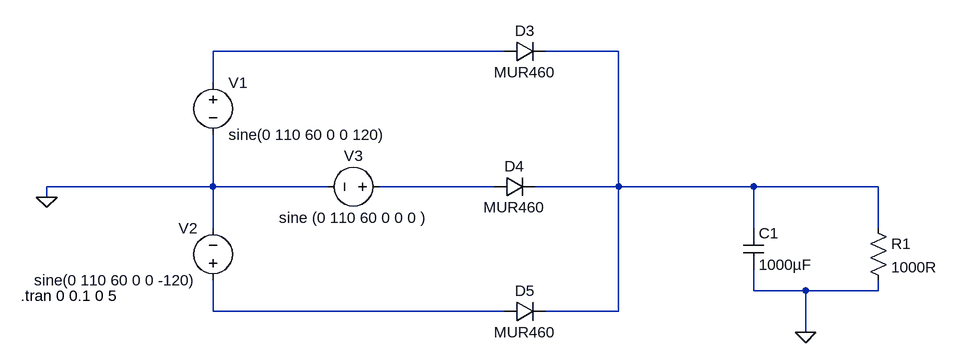
[diagram p0: schematic three-phase.asc]
three-phase.asc, the LTspice schematic file:
Version 4.1
SHEET 1 1236 680
WIRE 560 -16 112 -16
WIRE 736 -16 624 -16
WIRE 112 32 112 -16
WIRE 112 192 112 112
WIRE 112 192 -144 192
WIRE 288 192 112 192
WIRE 544 192 368 192
WIRE 736 192 736 -16
WIRE 736 192 608 192
WIRE 944 192 736 192
WIRE 1136 192 944 192
WIRE -144 208 -144 192
WIRE 112 256 112 192
WIRE 944 256 944 192
WIRE 1136 256 1136 192
WIRE 944 352 944 320
WIRE 1024 352 944 352
WIRE 1136 352 1136 336
WIRE 1136 352 1024 352
WIRE 112 384 112 336
WIRE 560 384 112 384
WIRE 736 384 736 192
WIRE 736 384 624 384
WIRE 1024 416 1024 352
FLAG -144 208 0
FLAG 1024 416 0
SYMBOL voltage 112 16 R0
WINDOW 123 0 0 Left 0
WINDOW 39 0 0 Left 0
SYMATTR InstName V1
SYMATTR Value sine(0 110 60 0 0 120)
SYMBOL voltage 112 352 R180
WINDOW 0 24 96 Left 2
WINDOW 3 24 16 Left 2
WINDOW 123 0 0 Left 0
WINDOW 39 0 0 Left 0
SYMATTR InstName V2
SYMATTR Value sine(0 110 60 0 0 -120)
SYMBOL voltage 384 192 R90
WINDOW 0 -32 56 VBottom 2
WINDOW 3 32 56 VTop 2
WINDOW 123 0 0 Left 0
WINDOW 39 0 0 Left 0
SYMATTR InstName V3
SYMATTR Value sine (0 110 60 0 0 0 )
SYMBOL diode 560 0 R270
WINDOW 0 32 32 VTop 2
WINDOW 3 0 32 VBottom 2
SYMATTR InstName D3
SYMATTR Value MUR460
SYMBOL diode 544 208 R270
WINDOW 0 32 32 VTop 2
WINDOW 3 0 32 VBottom 2
SYMATTR InstName D4
SYMATTR Value MUR460
SYMBOL diode 560 400 R270
WINDOW 0 32 32 VTop 2
WINDOW 3 0 32 VBottom 2
SYMATTR InstName D5
SYMATTR Value MUR460
SYMBOL cap 928 256 R0
SYMATTR InstName C1
SYMATTR Value 1000µF
SYMBOL res 1120 240 R0
SYMATTR InstName R1
SYMATTR Value 1000R
TEXT -184 360 Left 2 !.tran 0 0.1 0 5

The netlist it stands for:
* three-phase.asc
V1 N001 0 sine(0 110 60 0 0 120)
V2 N004 0 sine(0 110 60 0 0 -120)
V3 N003 0 sine (0 110 60 0 0 0 )
D3 N001 N002 MUR460
D4 N003 N002 MUR460
D5 N004 N002 MUR460
C1 N002 0 1000µF
R1 N002 0 1000R
.model D D
.lib standard.dio
.tran 0 0.1 0 5
.backanno
.end